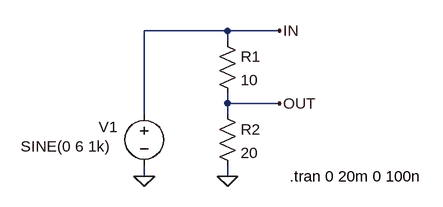
[diagram p0: schematic Sine_and_resistors.asc]
Sine_and_resistors.asc, the LTspice schematic file:
Version 4
SHEET 1 880 680
WIRE 224 48 96 48
WIRE 304 48 224 48
WIRE 224 64 224 48
WIRE 224 160 224 144
WIRE 304 160 224 160
WIRE 96 176 96 48
WIRE 224 176 224 160
WIRE 96 272 96 256
WIRE 224 272 224 256
FLAG 96 272 0
FLAG 224 272 0
FLAG 304 48 IN
FLAG 304 160 OUT
SYMBOL voltage 96 160 R0
WINDOW 0 -70 36 Left 2
WINDOW 3 -190 66 Left 2
WINDOW 123 0 0 Left 0
WINDOW 39 0 0 Left 0
SYMATTR InstName V1
SYMATTR Value SINE(0 6 1k)
SYMBOL res 208 48 R0
SYMATTR InstName R1
SYMATTR Value 10
SYMBOL res 208 160 R0
SYMATTR InstName R2
SYMATTR Value 20
TEXT 320 272 Left 2 !.tran 0 20m 0 100n

The netlist it stands for:
* Sine_and_resistors.asc
V1 IN 0 SINE(0 6 1k)
R1 IN OUT 10
R2 OUT 0 20
.tran 0 20m 0 100n
.backanno
.end